# EAGLE design adapter (EAGLE 7.1.0)
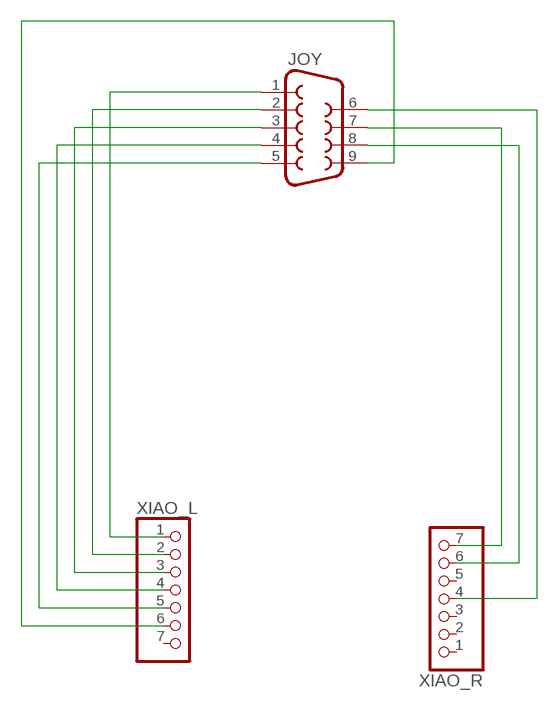
[diagram p0: schematic, sheet 1]

## Parts
JOY  F09D  [F09D]
XIAO_L  PINHD-1X7  [1X07]
XIAO_R  PINHD-1X7  [1X07]

## Nets
N$1: JOY.8 XIAO_R.6
N$2: JOY.1 XIAO_L.1
N$3: JOY.7 XIAO_R.7
N$4: JOY.2 XIAO_L.2
N$5: JOY.3 XIAO_L.3
N$6: JOY.4 XIAO_L.4
N$7: JOY.5 XIAO_L.5
N$8: JOY.9 XIAO_L.6
N$10: JOY.6 XIAO_R.4
Unconnected: XIAO_L.7 XIAO_R.1 XIAO_R.2 XIAO_R.3 XIAO_R.5

## Library data of the parts
JOY = con-subd:F09: SUB-D; OC_FARNELL: unknown; OC_NEWARK: unknown
XIAO_L XIAO_R = pinhead:PINHD-1X7: PIN HEADER

## Board
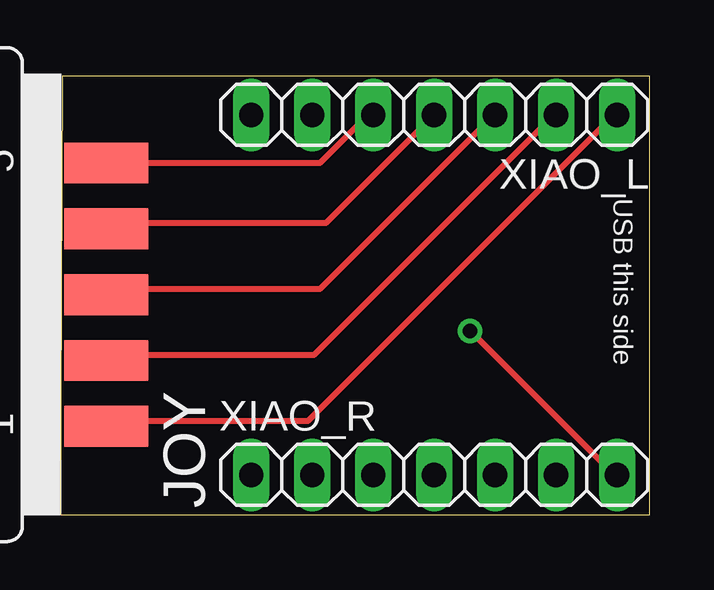
[diagram p1: board, top side]
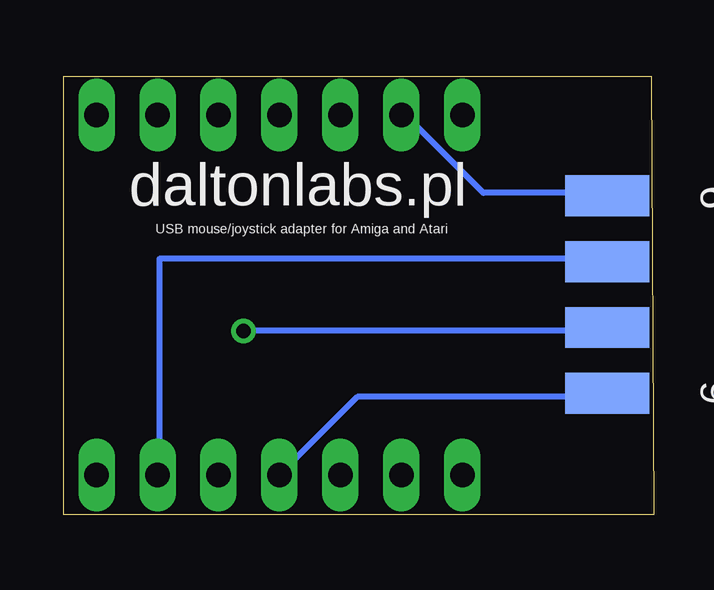
[diagram p2: board, bottom side, seen from below]

Size 24.58 x 18.28 mm. Coordinates in mm from the lower left corner, seen from the top.
Outline: 0,0 24.58,0 24.58,18.28 0.1,18.28 0,0
Copper layers (1*16): Top 0.035mm / dielectric 1.5mm / Bottom 0.035mm
Design rules "default": minimum track width 10mil, minimum drill 24mil, track to track 8mil, track to pad 8mil, pad to pad 8mil, via to via 8mil, smd to smd 8mil, copper to edge 40mil, drill to drill 8mil, minimum pad ring 10mil, minimum via ring 8mil, stop-mask expansion 4mil, vias tented up to drill 0mil, thermal gap 10mil

### Footprints (pad centres in the part's own frame; a part is rotated, then mirrored left to right if it is on the bottom)
F09D = smd 1.7 x 3.5: 1 -5.486,-6.045; 2 -2.743,-6.045; 3 0,-6.045; 4 2.743,-6.045; 5 5.486,-6.045 | smd 1.7 x 3.5 bottom: 6 -4.115,-6.045; 7 -1.372,-6.045; 8 1.372,-6.045; 9 4.115,-6.045
1X07 = drill 1.016 long: 1 -7.62,0; 2 -5.08,0; 3 -2.54,0; 4 0,0; 5 2.54,0; 6 5.08,0; 7 7.62,0

### Placement (x,y rotation side)
JOY  -4.11,9.18 90 top
XIAO_L  15.59,16.67 180 top
XIAO_R  15.59,1.67 0 top

### Tracks (layer width: path | path; a pad name or v marks a point on that pad's centre or on a via)
N$1
  Bottom 0.254: 2.92,10.62 2.46,10.62 JOY.8 2.84,10.67 20.59,10.67 20.59,1.67 XIAO_R.6
N$2
  Top 0.254: XIAO_L.1 23.09,16.67 10.34,3.92 2.09,3.92 JOY.1
N$3  (via drill 0.61)
  Top 0.254: v17.09,7.67 23.09,1.67 XIAO_R.7
  Bottom 0.254: v17.09,7.67 2.09,7.67 JOY.7
N$4
  Top 0.254: XIAO_L.2 20.59,16.67 10.59,6.67 2.09,6.67 JOY.2
N$5
  Top 0.254: 3.15,9.48 2.46,9.48 JOY.3 3.09,9.42 10.84,9.42 18.09,16.67 XIAO_L.3
N$6
  Top 0.254: JOY.4 2.09,12.17 11.09,12.17 XIAO_L.4
N$7
  Top 0.254: XIAO_L.5 12.84,16.67 10.84,14.67 2.09,14.67 JOY.5
N$8
  Bottom 0.254: XIAO_L.6 10.34,16.67 7.09,13.42 2.09,13.42 JOY.9
N$10
  Bottom 0.254: XIAO_R.4 12.34,4.92 2.09,4.92 JOY.6

### Text on the board
tNames: USB this side
bNames: daltonlabs.pl | USB mouse/joystick adapter for Amiga and Atari